# EAGLE schematic BEP33_2panel_test (EAGLE 6.4)

## Sheet 1 of 2
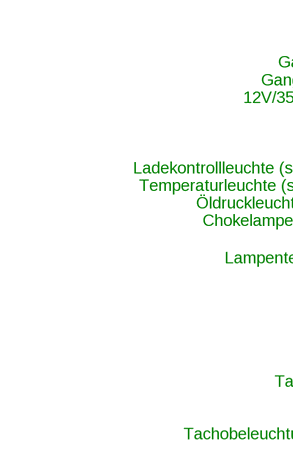
[diagram p0: schematic, sheet 1, part 1 of 2]
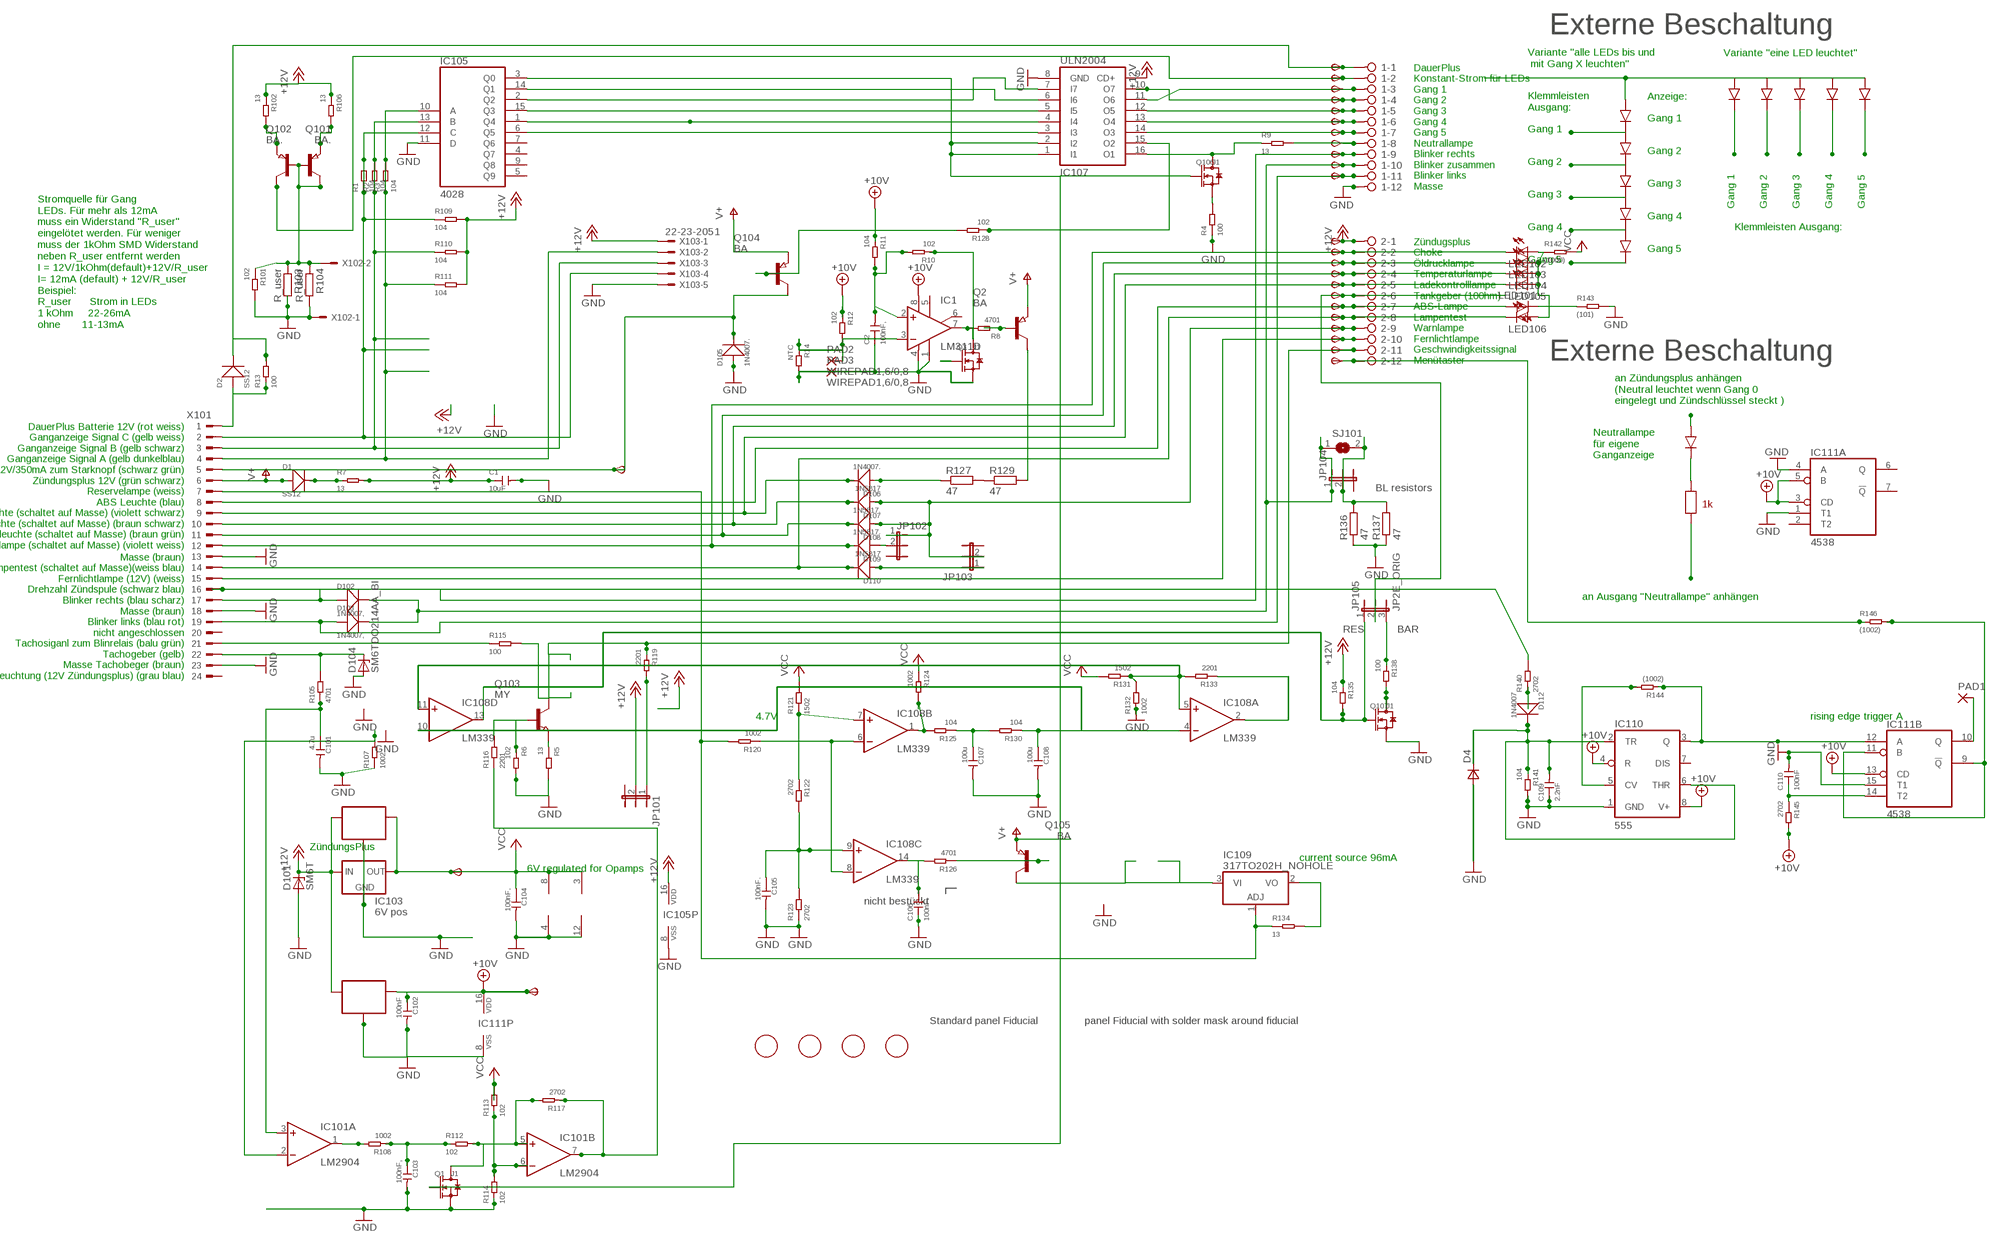
[diagram p1: schematic, sheet 1, part 2 of 2]

### Parts
1  2081-1132  [12-PIN]
2  2081-1132  [12-PIN]
6V  TPSB2.0  [B2.0]
10V  TPSB2.0  [B2.0]
C1  10uF  CERAMIC-100NF-50V-10%-X7R(0805)  [C0805]
C2  100nF,  CERAMIC-100NF-50V-10%-X7R(0805)  [C0805]
C101  4.7u  CERAMIC-4.7UF-25V-10%-X5R(0805)  [C0805]
C102  100nF  CERAMIC-100NF-50V-10%-X7R(0805)  [C0805]
C103  100nF,  CERAMIC-100NF-50V-10%-X7R(0805)  [C0805]
C104  100nF,  CERAMIC-100NF-50V-10%-X7R(0805)  [C0805]
C105  100nF.  CERAMIC-100NF-50V-10%-X7R(0805)  [C0805]
C106  100nF.  CERAMIC-100NF-50V-10%-X7R(0805)  [C0805]
C107  100u  CERAMIC-100UF-6.3V-20%-X5R(1206)  [C1206]
C108  100u  CERAMIC-100UF-6.3V-20%-X5R(1206)  [C1206]
C109  2.2nF  CERAMIC-100NF-50V-10%-X7R(0805)  [C0805]
C110  100nF  CERAMIC-100NF-50V-10%-X7R(0805)  [C0805]
D1  SS12  DIODE-GEN-PURPOSE-1KV-1A(DO-214AC)DO-214AC/1206  [DO-214AC_SLIM]
D2  SS12  DIODE-GEN-PURPOSE-1KV-1A(DO-214AC)DO-214AC/1206  [DO-214AC_SLIM]
D4  DSOD323  [SOD323]
D101  SM6T  [DO214AA]
D102  1N4007,  DIODE-GEN-PURPOSE-1KV-1A(DO-214AC)  [DO-214AC]
D103  1N4007,  DIODE-GEN-PURPOSE-1KV-1A(DO-214AC)  [DO-214AC]
D104  SM6TDO214AA_BI  [DO214AA_BI]
D105  1N4007.  DIODE-GEN-PURPOSE-1KV-1A(DO-214AC)  [DO-214AC]
D106  1N4007.  DIODE-GEN-PURPOSE-1KV-1A(DO-214AC)  [DO-214AC]
D107  1N5817  DIODE-GEN-PURPOSE-1KV-1A(DO-214AC)DO-214AC/1206  [DO-214AC_SLIM]
D108  1N5817.  DIODE-GEN-PURPOSE-1KV-1A(DO-214AC)DO-214AC/1206  [DO-214AC_SLIM]
D109  1N5817.  DIODE-GEN-PURPOSE-1KV-1A(DO-214AC)DO-214AC/1206  [DO-214AC_SLIM]
D110  1N5817  DIODE-GEN-PURPOSE-1KV-1A(DO-214AC)DO-214AC/1206  [DO-214AC_SLIM]
D112  1N4007  DIODE-GEN-PURPOSE-1KV-1A(DO-214AC)  [DO-214AC]
FID101  FIDUCIAL  [FIDUCIAL_1MM]
FID102  FIDUCIAL  [FIDUCIAL_1MM]
FID103  FIDUCIAL  [FIDUCIAL_1MM]
FID104  FIDUCIAL  [FIDUCIAL_1MM]
IC1  LM311D  [SO08]
IC101  LM2904  LM358D  [SO08]
IC102  78L06  78LXXSOT89_ROUND  [SOT89_ROUND]
IC103  6V pos  78LXX  [78LXX]
IC104  78L10  78LXXSOT89_ROUND  [SOT89_ROUND]
IC105  4028  4028D  [SO16]
IC107  ULN2004  ULN2004AD  [SO16]
IC108  LM339  LM339D  [SO14]
IC109  317TO202H_NOHOLE  [TO220H_NOHOLE]
IC110  555  NE555D  [SO08]
IC111  4538  4538D  [SO16]
JP101  JP2EJP2_SMALLPADS  [JP2_SMALLPADS]
JP102  JP2EJP2_SMALLPADS  [JP2_SMALLPADS]
JP103  JP2EJP2_SMALLPADS  [JP2_SMALLPADS]
JP104  JP2EJP2_SMALLPADS  [JP2_SMALLPADS]
JP105  JP2E_ORIG  [JP2_ORIG_SMALLPADS]
LED101  LEDLD260  [LD260]
LED102  LEDLD260  [LD260]
LED103  LEDLD260  [LD260]
LED104  LEDLD260  [LD260]
LED105  LEDLD260  [LD260]
LED106  LEDLD260  [LD260]
PAD1  1,6/0,8  [1,6/0,8]
PAD2  WIREPAD1,6/0,8  [1,6/0,8]
PAD3  WIREPAD1,6/0,8  [1,6/0,8]
Q1  J1  SMD-MOSFET-N-CH-50V-200MA-BSS138W-7-F(SOT-23)  [SOT-23]
Q2  BA  PNP-TRANSISTOR_SOT89  [SOT89]
Q3  J1  SMD-MOSFET-N-CH-50V-200MA-BSS138W-7-F(SOT-23)  [SOT-23]
Q101  BA.  PNP-TRANSISTOR_SOT89  [SOT89]
Q102  BA.  PNP-TRANSISTOR_SOT89  [SOT89]
Q103  MY  NPN-TRANSISTOR_SOT89  [SOT89]
Q104  BA  PNP-TRANSISTOR_SOT89  [SOT89]
Q105  BA  PNP-TRANSISTOR_SOT89  [SOT89]
Q106  J1  SMD-MOSFET-N-CH-50V-200MA-BSS138W-7-F(SOT-23)  [SOT-23]
Q107  J1  SMD-MOSFET-N-CH-50V-200MA-BSS138W-7-F(SOT-23)  [SOT-23]
R1  104  SMD-RES-10K-1%-1/8W(0805)  [R0805]
R2  104  SMD-RES-10K-1%-1/8W(0805)  [R0805]
R3  104  SMD-RES-10K-1%-1/8W(0805)  [R0805]
R4  100  SMD-RES-220R-5%-1/8W(0805)  [R0805]
R5  13  SMD-RES-13R-5%-1/4W(1206)  [R1206]
R6  102  SMD-RES-1K-5%-1/8W(0805)  [R0805]
R7  13  SMD-RES-13R-5%-1/4W(1206)  [R1206]
R8  4701  SMD-RES-4.7K-5%-1/8W(0805)  [R0805]
R9  13  SMD-RES-13R-5%-1/4W(1206)  [R1206]
R10  102  SMD-RES-1K-5%-1/8W(0805)  [R0805]
R11  104  SMD-RES-10K-1%-1/8W(0805)  [R0805]
R12  102  SMD-RES-1K-5%-1/8W(0805)  [R0805]
R13  100  SMD-RES-220R-5%-1/8W(0805)  [R0805]
R14  NTC  SMD-RES-1K-5%-1/8W(0805)  [R0805]
R101  102  SMD-RES-1K-5%-1/8W(0805)  [R0805]
R102  13  SMD-RES-13R-5%-1/4W(1206)  [R1206]
R103  R_user  R-EU_R0805  [R0805]
R104  R_user  R-EU_R0805  [R0805]
R105  4701  SMD-RES-4.7K-5%-1/8W(0805)  [R0805]
R106  13  SMD-RES-13R-5%-1/4W(1206)  [R1206]
R107  1002  SMD-RES-10K-1%-1/8W(0805)  [R0805]
R108  1002  SMD-RES-10K-1%-1/8W(0805)  [R0805]
R109  104  SMD-RES-10K-1%-1/8W(0805)  [R0805]
R110  104  SMD-RES-10K-1%-1/8W(0805)  [R0805]
R111  104  SMD-RES-10K-1%-1/8W(0805)  [R0805]
R112  102  SMD-RES-1K-5%-1/8W(0805)  [R0805]
R113  102  SMD-RES-1K-5%-1/8W(0805)  [R0805]
R114  102  SMD-RES-1K-5%-1/8W(0805)  [R0805]
R115  100  SMD-RES-220R-5%-1/8W(0805)  [R0805]
R116  2201  SMD-RES-4.7K-5%-1/8W(0805)  [R0805]
R117  2702  SMD-RES-4.7K-5%-1/8W(0805)  [R0805]
R119  2201  SMD-RES-2.2K-5%-1/8W(0805)  [R0805]
R120  1002  SMD-RES-10K-1%-1/8W(0805)  [R0805]
R121  1502  SMD-RES-10K-1%-1/8W(0805)  [R0805]
R122  2702  SMD-RES-4.7K-5%-1/8W(0805)  [R0805]
R123  2702  SMD-RES-4.7K-5%-1/8W(0805)  [R0805]
R124  1002  SMD-RES-10K-1%-1/8W(0805)  [R0805]
R125  104  SMD-RES-10K-1%-1/8W(0805)  [R0805]
R126  4701  SMD-RES-4.7K-5%-1/8W(0805)  [R0805]
R127  47  R-EU_V235/17_1MM  [V235/17_1MM]
R128  102  SMD-RES-1K-5%-1/8W(0805)  [R0805]
R129  47  R-EU_V235/17_1MM  [V235/17_1MM]
R130  104  SMD-RES-10K-1%-1/8W(0805)  [R0805]
R131  1502  SMD-RES-10K-1%-1/8W(0805)  [R0805]
R132  1002  SMD-RES-10K-1%-1/8W(0805)  [R0805]
R133  2201  SMD-RES-2.2K-5%-1/8W(0805)  [R0805]
R134  13  SMD-RES-13R-5%-1/4W(1206)  [R1206]
R135  104  SMD-RES-10K-1%-1/8W(0805)  [R0805]
R136  47  R-EU_V235/17_1MM  [V235/17_1MM]
R137  47  R-EU_V235/17_1MM  [V235/17_1MM]
R138  100  SMD-RES-2.2K-5%-1/8W(0805)  [R0805]
R140  2702  SMD-RES-10K-1%-1/8W(0805)  [R0805]
R141  104  SMD-RES-10K-1%-1/8W(0805)  [R0805]
R142  (1000)  SMD-RES-100R-5%-1/8W(0805)  [R0805]
R143  (101)  SMD-RES-100R-5%-1/8W(0805)  [R0805]
R144  (1002)  SMD-RES-10K-1%-1/8W(0805)  [R0805]
R145  2702  SMD-RES-4.7K-5%-1/8W(0805)  [R0805]
R146  (1002)  SMD-RES-4.7K-5%-1/8W(0805)  [R0805]
SJ101  SJ  [SJ]
START  TPSB2.0  [B2.0]
TP1  TPSB2.0  [B2.0]
TP2  TPSB2.0  [B2.0]
TP3  TPSB2.0  [B2.0]
TP4  TPSB2.0  [B2.0]
TP5  TPSB2.0  [B2.0]
TP6  TPSB2.0  [B2.0]
TP7  TPSB2.0  [B2.0]
TP8  TPSB2.0  [B2.0]
TP9  TPSB2.0  [B2.0]
TP10  TPSB2.0  [B2.0]
TP11  TPSB2.0  [B2.0]
TP12  TPSB2.0  [B2.0]
TP13  TPSB2.0  [B2.0]
TP16  TPSB2.0  [B2.0]
TP17  TPSB2.0  [B2.0]
TP18  TPSB2.0  [B2.0]
TP19  TPSB2.0  [B2.0]
TP21  TPSB2.0  [B2.0]
TP22  TPSB2.0  [B2.0]
TP23  TPSB2.0  [B2.0]
TP24  TPSB1,27  [B1,27]
TP25  TPSB2.0  [B2.0]
TP26  TPSB2.0  [B2.0]
X101  CON_BMWV2  [24-PIN_V2]
X102  22-23-2021  [22-23-2021]
X103  22-23-2051  [22-23-2051]

### Nets
+10V: 10V.TP(PP) C102.1 IC1.8(V+) IC104.1(OUT) IC110.4(R) IC110.8(V+) IC111.3(A:CD) IC111.5(A:B) IC111.13(B:CD) IC111.16(P:VDD) R11.1 R12.1 R145.2 ; also sheet 2
+12V: 2.1 C1.1 D101.C IC102.3(IN) IC103.IN IC104.3(IN) IC105.16(VDD) IC107.9(CD+) JP101.2 R7.2 R102.1 R106.1 R109.2 R110.2 R111.2 R135.1 TP12.TP(PP) X103.1 ; also sheet 2
+12V1: 2.11 Q103.2(C) R115.2 R119.1 TP26.TP(PP)
GND: 1.12 C1.2 C2.1 C101.2 C102.2 C103.2 C104.2 C105.2 C106.1 C107.2 C108.2 C109.1 C110.2 D4.2(A) D101.A D104.A D105.1(+) IC1.1(GND) IC1.4(V-) IC101.4(P:V-) IC102.2(GND) IC102.2@1(GND) IC103.GND IC104.2(GND) IC104.2@1(GND) IC105.8(VSS) IC105.11(D) IC107.8(GND) IC108.12(P:GND) IC110.1(GND) IC111.1(A:T1) IC111.4(A:A) IC111.8(P:VSS) IC111.15(B:T1) PAD3.1(P) Q1.2(S) Q3.2(S) Q107.2(S) R4.1 R5.2 R6.2 R14.2 R101.2 R103.2 R104.2 R107.1 R114.1 R123.1 R132.1 R136.1 R137.1 R141.2 R143.2 X101.13 X101.18 X101.23 X102.1 X103.5 ; also sheet 2
N$1: 2.9 D107.1(+) D108.1(+) JP102.1 JP103.2 TP24.TP(PP)
N$2: IC105.10(A) R3.1 R3.2 R111.1 X101.4 X103.2
N$3: IC105.13(B) R2.1 R2.2 R110.1 X101.3 X103.3
N$4: 2.7 LED101.A TP22.TP(PP) X101.8
N$5: Q101.3(E) R102.2
N$6: Q2.1(B) R8.1
N$7: IC101.2(A:-IN) R107.2
N$8: R127.2 R129.1
N$9: Q102.3(E) R106.2
N$11: D105.2(-) Q104.2(C) START.TP(PP) X101.5
N$12: 2.2 D109.2(-) LED102.K(C) TP16.TP(PP) X101.12
N$13: 2.3 D108.2(-) LED103.K(C) TP17.TP(PP) X101.11
N$14: 2.4 D107.2(-) LED104.K(C) TP18.TP(PP) X101.10
N$15: IC109.3(VI) Q105.2(C)
N$16: IC108.6(B:-IN) IC108.8(C:-IN) R120.1
N$17: IC105.12(C) R1.1 R1.2 R109.1 X101.2 X103.4
N$18: IC105.15(Q3) IC107.5(I5)
N$19: 2.8 D110.2(-) LED106.K(C) TP23.TP(PP) X101.14
N$20: 1.9 D102.1(+) TP9.TP(PP) X101.17
N$21: 1.11 D103.1(+) TP11.TP(PP) X101.19
N$22: IC111.9(B:!Q) IC111.11(B:B) R146.2
N$23: D104.C R105.2 X101.22
N$24: C101.1 IC101.3(A:+IN) R105.1
N$25: 1.6 IC107.13(O4) TP6.TP(PP)
N$26: 1.7 IC107.14(O3) TP7.TP(PP)
N$27: D1.2(-) R7.1
N$28: 2.6 JP105.2 TP21.TP(PP)
N$29: JP101.1 R119.2
N$30: C105.1 IC108.9(C:+IN) R122.2 R123.2
N$31: C106.2 IC108.14(C:OUT) R126.2
N$32: IC1.7(OUT) Q3.3(D) R8.2 R10.1
N$34: LED101.K(C) R143.1
N$35: IC109.1(ADJ) R120.2 R134.1 X101.7
N$36: Q105.1(B) R126.1
N$37: IC105.2(Q2) IC107.7(I7)
N$38: 1.3 IC107.11(O6) TP3.TP(PP)
N$39: 1.5 IC107.12(O5) TP5.TP(PP)
N$41: LED102.A LED103.A LED104.A LED105.A LED106.A R142.1
N$42: R140.2 X101.16
N$43: Q104.1(B) R128.2
N$44: IC105.3(Q0) IC107.1(I1) IC107.2(I2) Q1.1(G) Q106.1(G)
N$45: C107.1 R125.1 R130.2
N$46: C108.1 IC108.4(A:-IN) IC108.10(D:-IN) R130.1
N$47: IC108.5(A:+IN) IC108.11(D:+IN) R131.1 R132.2 R133.2
N$48: Q107.3(D) R138.2
N$49: Q3.1(G)
N$50: IC105.1(Q4) IC107.4(I4)
N$51: R115.1 X101.21
N$52: IC107.16(O1) Q106.3(D) R9.1
N$53: 2.10 TP25.TP(PP) X101.15
N$54: D106.1(+) R127.1
N$55: 2.5 D106.2(-) LED105.K(C) TP19.TP(PP) X101.9
N$56: IC105.14(Q1) IC107.6(I6)
N$57: Q101.1(B) Q102.1(B) Q102.2(C) R101.1 R103.1 R104.1 X102.2
N$58: 1.8 R9.2 TP8.TP(PP)
N$59: 1.2 Q101.2(C) TP2.TP(PP)
N$60: IC108.13(D:OUT) JP105.1 Q107.1(G) R135.2
N$61: IC105.6(Q5) IC107.3(I3)
N$64: IC109.2(VO) R134.2
N$65: IC110.5(CV) R144.2
N$67: 1.4 IC107.10(O7) TP4.TP(PP)
N$69: 1.1 D2.2(-) R13.2 TP1.TP(PP)
N$83: IC108.7(B:+IN) R121.1 R122.1
N$84: Q106.2(S) R4.2
N$85: Q103.1(B) R6.1 R116.2
N$86: IC110.3(Q) IC111.12(B:A) R144.1
N$87: D112.1(+) R140.1
N$88: IC107.15(O2) R128.1
N$89: C110.1 IC111.14(B:T2) R145.1
N$90: 2.12 R146.1 TP13.TP(PP)
N$91: D2.1(+) R13.1 X101.1
N$92: IC101.1(A:OUT) R108.2
N$93: 1.10 D102.2(-) D103.2(-) JP104.1 SJ101.1 TP10.TP(PP)
N$94: JP104.2 R136.2 R137.2 SJ101.2
N$95: D109.1(+) JP102.2
N$96: C103.1 R108.1 R112.1
N$97: IC101.5(B:+IN) Q1.3(D) R112.2 R117.2
N$98: D110.1(+) JP103.1
N$99: JP105.3 R138.1
N$100: Q103.3(E) R5.1
N$101: IC101.6(B:-IN) R113.1 R114.2
N$102: C109.2 D4.1(C) D112.2(-) IC110.2(TR) IC110.6(THR) R141.1
N$103: C2.2 IC1.2(+IN) R10.2 R11.2
N$104: Q2.2(C) R129.2
N$105: IC1.3(-IN) PAD2.1(P) R12.2 R14.1
N$106: IC111.10(B:Q) PAD1.1(P)
N$107: IC101.7(B:OUT) R116.1 R117.1
N$108: IC108.2(A:OUT) R133.1
N$580: IC108.1(B:OUT) R124.2 R125.2
V+: D1.1(+) Q2.3(E) Q104.3(E) Q105.3(E) X101.6 ; also sheet 2
VCC: 6V.TP(PP) C104.1 IC101.8(P:V+) IC102.1(OUT) IC103.OUT IC108.3(P:V+) R113.2 R121.2 R124.1 R131.2 R142.2 ; also sheet 2
Unconnected: IC1.5(ON) IC1.6(ON/STR) IC105.4(Q7) IC105.5(Q9) IC105.7(Q6) IC105.9(Q8) IC110.7(DIS) IC111.2(A:T2) IC111.6(A:Q) IC111.7(A:!Q) X101.20 X101.24

### Notes on the sheet
- Externe Beschaltung
- Variante "eine LED leuchtet"
- Variante "alle LEDs bis und
   mit Gang X leuchten"
- Anzeige:
- Klemmleisten
  Ausgang:
- Gang 1
- DauerPlus
  Konstant-Strom für LEDs
  Gang 1
  Gang 2
  Gang 3
  Gang 4
  Gang 5
  Neutrallampe
  Blinker rechts
  Blinker zusammen
  Blinker links
  Masse
- Gang 1
- Gang 2
- Gang 2
- Gang 3
- Gang 3
- Gang 1 | Gang 2 | Gang 3 | Gang 4 | Gang 5
- Gang 4
- Gang 4 | Klemmleisten Ausgang:
- Gang 5
- Gang 5
- Zündugsplus
  Choke
  Öldrucklampe
  Temperaturlampe
  Ladekontrolllampe
  Tankgeber (100hm)
  ABS-Lampe
  Lampentest
  Warnlampe
  Fernlichtlampe
  Geschwindigkeitssignal
  Menütaster
- Stromquelle für Gang
  LEDs. Für mehr als 12mA
  muss ein Widerstand "R_user"
  eingelötet werden. Für weniger
  muss der 1kOhm SMD Widerstand
  neben R_user entfernt werden
  I = 12V/1kOhm(default)+12V/R_user
  I= 12mA (default) + 12V/R_user
  Beispiel:
  R_user      Strom in LEDs
  1 kOhm     22-26mA
  ohne       11-13mA
- Externe Beschaltung
- an Zündungsplus anhängen
  (Neutral leuchtet wenn Gang 0
  eingelegt und Zündschlüssel steckt )
- Neutrallampe
  für eigene
  Ganganzeige
- DauerPlus Batterie 12V (rot weiss)
  Ganganzeige Signal C (gelb weiss)
  Ganganzeige Signal B (gelb schwarz)
  Ganganzeige Signal A (gelb dunkelblau)
  12V/350mA zum Starknopf (schwarz grün)
  Zündungsplus 12V (grün schwarz)
  Reservelampe (weiss)
  ABS Leuchte (blau)
  Ladekontrollleuchte (schaltet auf Masse) (violett schwarz)
  Temperaturleuchte (schaltet auf Masse) (braun schwarz)
  Öldruckleuchte (schaltet auf Masse) (braun grün)
  Chokelampe (schaltet auf Masse) (violett weiss)
- BL resistors
- 1k
- an Ausgang "Neutrallampe" anhängen
- Masse (braun)
  Lampentest (schaltet auf Masse)(weiss blau)
  Fernlichtlampe (12V) (weiss)
  Drehzahl Zündspule (schwarz blau)
  Blinker rechts (blau scharz)
  Masse (braun)
  Blinker links (blau rot)
  nicht angeschlossen
  Tachosiganl zum Blinrelais (balu grün)
  Tachogeber (gelb)
  Masse Tachobeger (braun)
  Tachobeleuchtung (12V Zündungsplus) (grau blau)
- RES | BAR
- 4.7V | rising edge trigger A
- ZündungsPlus
- current source 96mA
- 6V regulated for Opamps
- nicht bestückt
- Standard panel Fiducial | panel Fiducial with solder mask around fiducial

## Sheet 2 of 2
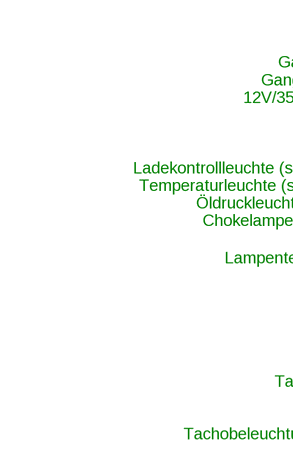
[diagram p2: schematic, sheet 2, part 1 of 2]
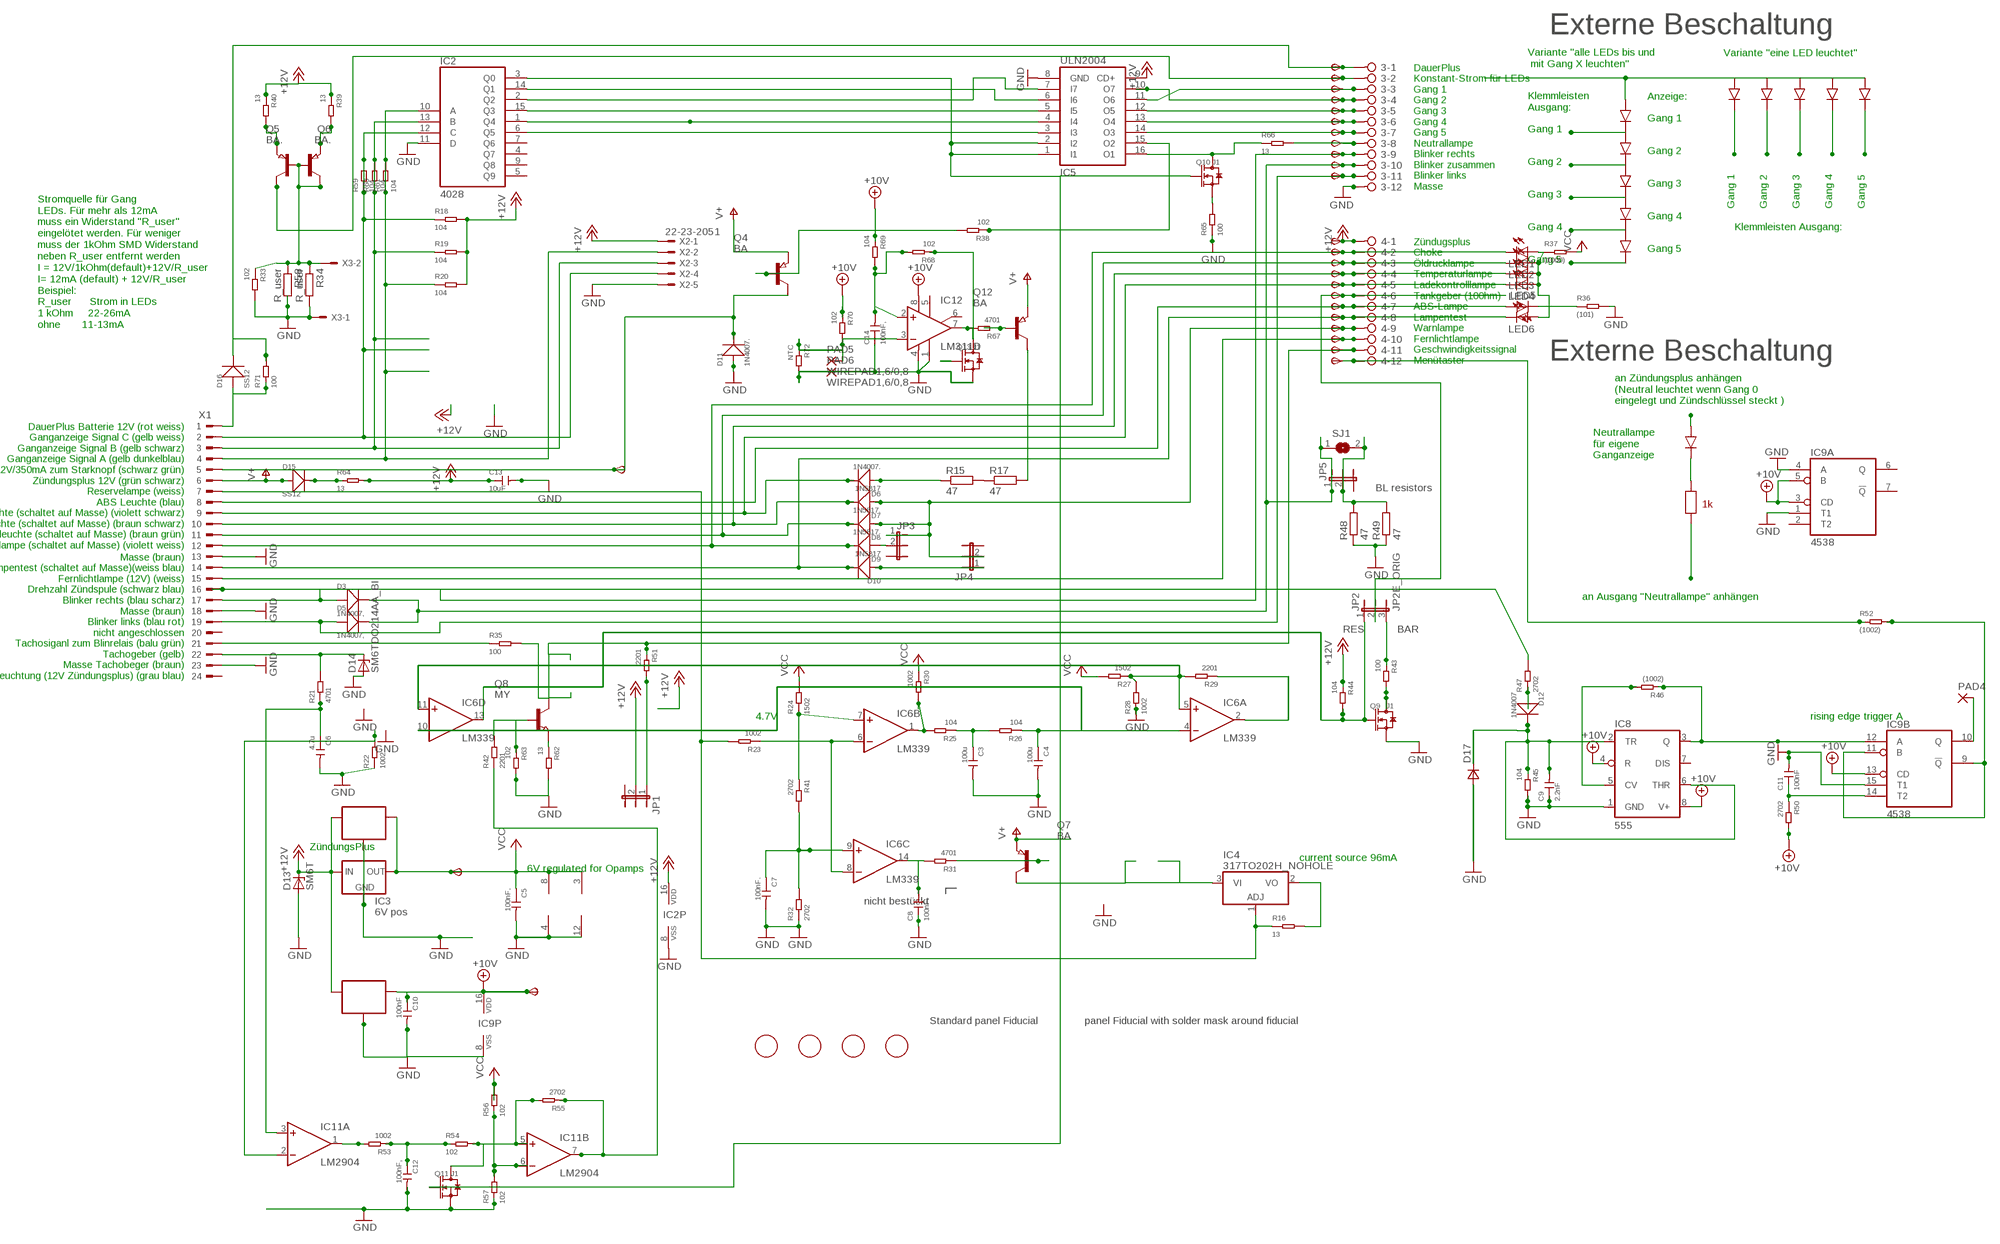
[diagram p3: schematic, sheet 2, part 2 of 2]

### Parts
3  2081-1132  [12-PIN]
4  2081-1132  [12-PIN]
6V1  TPSB2.0  [B2.0]
10V1  TPSB2.0  [B2.0]
C3  100u  CERAMIC-100UF-6.3V-20%-X5R(1206)  [C1206]
C4  100u  CERAMIC-100UF-6.3V-20%-X5R(1206)  [C1206]
C5  100nF,  CERAMIC-100NF-50V-10%-X7R(0805)  [C0805]
C6  4.7u  CERAMIC-4.7UF-25V-10%-X5R(0805)  [C0805]
C7  100nF.  CERAMIC-100NF-50V-10%-X7R(0805)  [C0805]
C8  100nF.  CERAMIC-100NF-50V-10%-X7R(0805)  [C0805]
C9  2.2nF  CERAMIC-100NF-50V-10%-X7R(0805)  [C0805]
C10  100nF  CERAMIC-100NF-50V-10%-X7R(0805)  [C0805]
C11  100nF  CERAMIC-100NF-50V-10%-X7R(0805)  [C0805]
C12  100nF,  CERAMIC-100NF-50V-10%-X7R(0805)  [C0805]
C13  10uF  CERAMIC-100NF-50V-10%-X7R(0805)  [C0805]
C14  100nF,  CERAMIC-100NF-50V-10%-X7R(0805)  [C0805]
D3  1N4007,  DIODE-GEN-PURPOSE-1KV-1A(DO-214AC)  [DO-214AC]
D5  1N4007,  DIODE-GEN-PURPOSE-1KV-1A(DO-214AC)  [DO-214AC]
D6  1N4007.  DIODE-GEN-PURPOSE-1KV-1A(DO-214AC)  [DO-214AC]
D7  1N5817  DIODE-GEN-PURPOSE-1KV-1A(DO-214AC)DO-214AC/1206  [DO-214AC_SLIM]
D8  1N5817.  DIODE-GEN-PURPOSE-1KV-1A(DO-214AC)DO-214AC/1206  [DO-214AC_SLIM]
D9  1N5817.  DIODE-GEN-PURPOSE-1KV-1A(DO-214AC)DO-214AC/1206  [DO-214AC_SLIM]
D10  1N5817  DIODE-GEN-PURPOSE-1KV-1A(DO-214AC)DO-214AC/1206  [DO-214AC_SLIM]
D11  1N4007.  DIODE-GEN-PURPOSE-1KV-1A(DO-214AC)  [DO-214AC]
D12  1N4007  DIODE-GEN-PURPOSE-1KV-1A(DO-214AC)  [DO-214AC]
D13  SM6T  [DO214AA]
D14  SM6TDO214AA_BI  [DO214AA_BI]
D15  SS12  DIODE-GEN-PURPOSE-1KV-1A(DO-214AC)DO-214AC/1206  [DO-214AC_SLIM]
D16  SS12  DIODE-GEN-PURPOSE-1KV-1A(DO-214AC)DO-214AC/1206  [DO-214AC_SLIM]
D17  DSOD323  [SOD323]
FID3  FIDUCIAL  [FIDUCIAL_1MM]
FID4  FIDUCIAL  [FIDUCIAL_1MM]
FID5  FIDUCIAL  [FIDUCIAL_1MM]
FID6  FIDUCIAL  [FIDUCIAL_1MM]
IC2  4028  4028D  [SO16]
IC3  6V pos  78LXX  [78LXX]
IC4  317TO202H_NOHOLE  [TO220H_NOHOLE]
IC5  ULN2004  ULN2004AD  [SO16]
IC6  LM339  LM339D  [SO14]
IC7  78L06  78LXXSOT89_ROUND  [SOT89_ROUND]
IC8  555  NE555D  [SO08]
IC9  4538  4538D  [SO16]
IC10  78L10  78LXXSOT89_ROUND  [SOT89_ROUND]
IC11  LM2904  LM358D  [SO08]
IC12  LM311D  [SO08]
JP1  JP2EJP2_SMALLPADS  [JP2_SMALLPADS]
JP2  JP2E_ORIG  [JP2_ORIG_SMALLPADS]
JP3  JP2EJP2_SMALLPADS  [JP2_SMALLPADS]
JP4  JP2EJP2_SMALLPADS  [JP2_SMALLPADS]
JP5  JP2EJP2_SMALLPADS  [JP2_SMALLPADS]
LED1  LEDLD260  [LD260]
LED2  LEDLD260  [LD260]
LED3  LEDLD260  [LD260]
LED4  LEDLD260  [LD260]
LED5  LEDLD260  [LD260]
LED6  LEDLD260  [LD260]
PAD4  1,6/0,8  [1,6/0,8]
PAD5  WIREPAD1,6/0,8  [1,6/0,8]
PAD6  WIREPAD1,6/0,8  [1,6/0,8]
Q4  BA  PNP-TRANSISTOR_SOT89  [SOT89]
Q5  BA.  PNP-TRANSISTOR_SOT89  [SOT89]
Q6  BA.  PNP-TRANSISTOR_SOT89  [SOT89]
Q7  BA  PNP-TRANSISTOR_SOT89  [SOT89]
Q8  MY  NPN-TRANSISTOR_SOT89  [SOT89]
Q9  J1  SMD-MOSFET-N-CH-50V-200MA-BSS138W-7-F(SOT-23)  [SOT-23]
Q10  J1  SMD-MOSFET-N-CH-50V-200MA-BSS138W-7-F(SOT-23)  [SOT-23]
Q11  J1  SMD-MOSFET-N-CH-50V-200MA-BSS138W-7-F(SOT-23)  [SOT-23]
Q12  BA  PNP-TRANSISTOR_SOT89  [SOT89]
Q13  J1  SMD-MOSFET-N-CH-50V-200MA-BSS138W-7-F(SOT-23)  [SOT-23]
R15  47  R-EU_V235/17_1MM  [V235/17_1MM]
R16  13  SMD-RES-13R-5%-1/4W(1206)  [R1206]
R17  47  R-EU_V235/17_1MM  [V235/17_1MM]
R18  104  SMD-RES-10K-1%-1/8W(0805)  [R0805]
R19  104  SMD-RES-10K-1%-1/8W(0805)  [R0805]
R20  104  SMD-RES-10K-1%-1/8W(0805)  [R0805]
R21  4701  SMD-RES-4.7K-5%-1/8W(0805)  [R0805]
R22  1002  SMD-RES-10K-1%-1/8W(0805)  [R0805]
R23  1002  SMD-RES-10K-1%-1/8W(0805)  [R0805]
R24  1502  SMD-RES-10K-1%-1/8W(0805)  [R0805]
R25  104  SMD-RES-10K-1%-1/8W(0805)  [R0805]
R26  104  SMD-RES-10K-1%-1/8W(0805)  [R0805]
R27  1502  SMD-RES-10K-1%-1/8W(0805)  [R0805]
R28  1002  SMD-RES-10K-1%-1/8W(0805)  [R0805]
R29  2201  SMD-RES-2.2K-5%-1/8W(0805)  [R0805]
R30  1002  SMD-RES-10K-1%-1/8W(0805)  [R0805]
R31  4701  SMD-RES-4.7K-5%-1/8W(0805)  [R0805]
R32  2702  SMD-RES-4.7K-5%-1/8W(0805)  [R0805]
R33  102  SMD-RES-1K-5%-1/8W(0805)  [R0805]
R34  R_user  R-EU_R0805  [R0805]
R35  100  SMD-RES-220R-5%-1/8W(0805)  [R0805]
R36  (101)  SMD-RES-100R-5%-1/8W(0805)  [R0805]
R37  (1000)  SMD-RES-100R-5%-1/8W(0805)  [R0805]
R38  102  SMD-RES-1K-5%-1/8W(0805)  [R0805]
R39  13  SMD-RES-13R-5%-1/4W(1206)  [R1206]
R40  13  SMD-RES-13R-5%-1/4W(1206)  [R1206]
R41  2702  SMD-RES-4.7K-5%-1/8W(0805)  [R0805]
R42  2201  SMD-RES-4.7K-5%-1/8W(0805)  [R0805]
R43  100  SMD-RES-2.2K-5%-1/8W(0805)  [R0805]
R44  104  SMD-RES-10K-1%-1/8W(0805)  [R0805]
R45  104  SMD-RES-10K-1%-1/8W(0805)  [R0805]
R46  (1002)  SMD-RES-10K-1%-1/8W(0805)  [R0805]
R47  2702  SMD-RES-10K-1%-1/8W(0805)  [R0805]
R48  47  R-EU_V235/17_1MM  [V235/17_1MM]
R49  47  R-EU_V235/17_1MM  [V235/17_1MM]
R50  2702  SMD-RES-4.7K-5%-1/8W(0805)  [R0805]
R51  2201  SMD-RES-2.2K-5%-1/8W(0805)  [R0805]
R52  (1002)  SMD-RES-4.7K-5%-1/8W(0805)  [R0805]
R53  1002  SMD-RES-10K-1%-1/8W(0805)  [R0805]
R54  102  SMD-RES-1K-5%-1/8W(0805)  [R0805]
R55  2702  SMD-RES-4.7K-5%-1/8W(0805)  [R0805]
R56  102  SMD-RES-1K-5%-1/8W(0805)  [R0805]
R57  102  SMD-RES-1K-5%-1/8W(0805)  [R0805]
R58  R_user  R-EU_R0805  [R0805]
R59  104  SMD-RES-10K-1%-1/8W(0805)  [R0805]
R60  104  SMD-RES-10K-1%-1/8W(0805)  [R0805]
R61  104  SMD-RES-10K-1%-1/8W(0805)  [R0805]
R62  13  SMD-RES-13R-5%-1/4W(1206)  [R1206]
R63  102  SMD-RES-1K-5%-1/8W(0805)  [R0805]
R64  13  SMD-RES-13R-5%-1/4W(1206)  [R1206]
R65  100  SMD-RES-220R-5%-1/8W(0805)  [R0805]
R66  13  SMD-RES-13R-5%-1/4W(1206)  [R1206]
R67  4701  SMD-RES-4.7K-5%-1/8W(0805)  [R0805]
R68  102  SMD-RES-1K-5%-1/8W(0805)  [R0805]
R69  104  SMD-RES-10K-1%-1/8W(0805)  [R0805]
R70  102  SMD-RES-1K-5%-1/8W(0805)  [R0805]
R71  100  SMD-RES-220R-5%-1/8W(0805)  [R0805]
R72  NTC  SMD-RES-1K-5%-1/8W(0805)  [R0805]
SJ1  SJ  [SJ]
START1  TPSB2.0  [B2.0]
TP14  TPSB2.0  [B2.0]
TP15  TPSB2.0  [B2.0]
TP20  TPSB2.0  [B2.0]
TP27  TPSB2.0  [B2.0]
TP28  TPSB2.0  [B2.0]
TP29  TPSB2.0  [B2.0]
TP30  TPSB2.0  [B2.0]
TP31  TPSB2.0  [B2.0]
TP32  TPSB2.0  [B2.0]
TP33  TPSB2.0  [B2.0]
TP34  TPSB2.0  [B2.0]
TP35  TPSB2.0  [B2.0]
TP36  TPSB2.0  [B2.0]
TP37  TPSB2.0  [B2.0]
TP38  TPSB2.0  [B2.0]
TP39  TPSB2.0  [B2.0]
TP40  TPSB2.0  [B2.0]
TP41  TPSB2.0  [B2.0]
TP42  TPSB1,27  [B1,27]
TP43  TPSB2.0  [B2.0]
TP44  TPSB2.0  [B2.0]
TP45  TPSB2.0  [B2.0]
TP46  TPSB2.0  [B2.0]
X1  CON_BMWV2  [24-PIN_V2]
X2  22-23-2051  [22-23-2051]
X3  22-23-2021  [22-23-2021]

### Nets
+10V: 10V1.TP(PP) C10.1 IC8.4(R) IC8.8(V+) IC9.3(A:CD) IC9.5(A:B) IC9.13(B:CD) IC9.16(P:VDD) IC10.1(OUT) IC12.8(V+) R50.2 R69.1 R70.1 ; also sheet 1
+12V: 4.1 C13.1 D13.C IC2.16(VDD) IC3.IN IC5.9(CD+) IC7.3(IN) IC10.3(IN) JP1.2 R18.2 R19.2 R20.2 R39.1 R40.1 R44.1 R64.2 TP45.TP(PP) X2.1 ; also sheet 1
+12V2: 4.11 Q8.2(C) R35.2 R51.1 TP44.TP(PP)
GND: 3.12 C3.2 C4.2 C5.2 C6.2 C7.2 C8.1 C9.1 C10.2 C11.2 C12.2 C13.2 C14.1 D11.1(+) D13.A D14.A D17.2(A) IC2.8(VSS) IC2.11(D) IC3.GND IC5.8(GND) IC6.12(P:GND) IC7.2(GND) IC7.2@1(GND) IC8.1(GND) IC9.1(A:T1) IC9.4(A:A) IC9.8(P:VSS) IC9.15(B:T1) IC10.2(GND) IC10.2@1(GND) IC11.4(P:V-) IC12.1(GND) IC12.4(V-) PAD6.1(P) Q9.2(S) Q11.2(S) Q13.2(S) R22.1 R28.1 R32.1 R33.2 R34.2 R36.2 R45.2 R48.1 R49.1 R57.1 R58.2 R62.2 R63.2 R65.1 R72.2 X1.13 X1.18 X1.23 X2.5 X3.1 ; also sheet 1
N$109: R15.2 R17.1
N$110: 4.9 D7.1(+) D8.1(+) JP3.1 JP4.2 TP42.TP(PP)
N$111: IC2.10(A) R20.1 R61.1 R61.2 X1.4 X2.2
N$112: IC2.13(B) R19.1 R60.1 R60.2 X1.3 X2.3
N$113: D11.2(-) Q4.2(C) START1.TP(PP) X1.5
N$114: IC2.12(C) R18.1 R59.1 R59.2 X1.2 X2.4
N$115: 4.7 LED5.A TP40.TP(PP) X1.8
N$116: 4.2 D9.2(-) LED1.K(C) TP35.TP(PP) X1.12
N$117: 4.3 D8.2(-) LED2.K(C) TP36.TP(PP) X1.11
N$118: 4.4 D7.2(-) LED3.K(C) TP37.TP(PP) X1.10
N$119: 4.8 D10.2(-) LED6.K(C) TP41.TP(PP) X1.14
N$120: 3.9 D3.1(+) TP32.TP(PP) X1.17
N$121: 3.11 D5.1(+) TP34.TP(PP) X1.19
N$122: D14.C R21.2 X1.22
N$123: C6.1 IC11.3(A:+IN) R21.1
N$124: IC6.1(B:OUT) R25.2 R30.2
N$125: C3.1 R25.1 R26.2
N$126: C4.1 IC6.4(A:-IN) IC6.10(D:-IN) R26.1
N$127: IC6.5(A:+IN) IC6.11(D:+IN) R27.1 R28.2 R29.2
N$128: C7.1 IC6.9(C:+IN) R32.2 R41.2
N$129: C8.2 IC6.14(C:OUT) R31.2
N$130: Q7.1(B) R31.1
N$131: IC2.2(Q2) IC5.7(I7)
N$132: 3.5 IC5.12(O5) TP28.TP(PP)
N$133: IC2.1(Q4) IC5.4(I4)
N$134: 4.10 TP43.TP(PP) X1.15
N$135: 4.5 D6.2(-) LED4.K(C) TP38.TP(PP) X1.9
N$136: D6.1(+) R15.1
N$137: IC2.6(Q5) IC5.3(I3)
N$138: 3.4 IC5.10(O7) TP27.TP(PP)
N$139: IC4.1(ADJ) R16.1 R23.2 X1.7
N$140: IC6.6(B:-IN) IC6.8(C:-IN) R23.1
N$141: 3.2 Q6.2(C) TP15.TP(PP)
N$142: 3.1 D16.2(-) R71.2 TP14.TP(PP)
N$156: R47.2 X1.16
N$157: IC2.15(Q3) IC5.5(I5)
N$158: 3.6 IC5.13(O4) TP29.TP(PP)
N$159: 3.7 IC5.14(O3) TP30.TP(PP)
N$160: 4.6 JP2.2 TP39.TP(PP)
N$161: LED5.K(C) R36.1
N$162: LED1.A LED2.A LED3.A LED4.A LED6.A R37.1
N$163: Q4.1(B) R38.2
N$164: IC2.3(Q0) IC5.1(I1) IC5.2(I2) Q10.1(G) Q11.1(G)
N$165: IC2.14(Q1) IC5.6(I6)
N$166: 3.3 IC5.11(O6) TP20.TP(PP)
N$167: Q5.1(B) Q5.2(C) Q6.1(B) R33.1 R34.1 R58.1 X3.2
N$168: Q6.3(E) R40.2
N$169: Q5.3(E) R39.2
N$170: IC6.7(B:+IN) R24.1 R41.1
N$171: IC11.2(A:-IN) R22.2
N$172: Q8.1(B) R42.2 R63.1
N$173: Q9.3(D) R43.2
N$174: IC4.2(VO) R16.2
N$175: IC4.3(VI) Q7.2(C)
N$176: IC8.5(CV) R46.2
N$177: IC8.3(Q) IC9.12(B:A) R46.1
N$178: D12.1(+) R47.1
N$179: 3.10 D3.2(-) D5.2(-) JP5.1 SJ1.1 TP33.TP(PP)
N$180: JP5.2 R48.2 R49.2 SJ1.2
N$181: IC9.9(B:!Q) IC9.11(B:B) R52.2
N$182: C11.1 IC9.14(B:T2) R50.1
N$183: JP1.1 R51.2
N$184: IC5.15(O2) R38.1
N$185: 4.12 R52.1 TP46.TP(PP)
N$186: D9.1(+) JP3.2
N$187: IC11.1(A:OUT) R53.2
N$188: C12.1 R53.1 R54.1
N$189: IC11.5(B:+IN) Q11.3(D) R54.2 R55.2
N$190: IC11.6(B:-IN) R56.1 R57.2
N$196: D10.1(+) JP4.1
N$197: JP2.3 R43.1
N$198: IC6.13(D:OUT) JP2.1 Q9.1(G) R44.2
N$199: R35.1 X1.21
N$200: IC5.16(O1) Q10.3(D) R66.1
N$201: D15.2(-) R64.1
N$202: 3.8 R66.2 TP31.TP(PP)
N$203: Q10.2(S) R65.2
N$204: D16.1(+) R71.1 X1.1
N$205: Q8.3(E) R62.1
N$206: C9.2 D12.2(-) D17.1(C) IC8.2(TR) IC8.6(THR) R45.1
N$207: Q12.1(B) R67.1
N$208: IC12.7(OUT) Q13.3(D) R67.2 R68.1
N$209: C14.2 IC12.2(+IN) R68.2 R69.2
N$210: IC12.3(-IN) PAD5.1(P) R70.2 R72.1
N$211: Q12.2(C) R17.2
N$212: IC9.10(B:Q) PAD4.1(P)
N$213: IC11.7(B:OUT) R42.1 R55.1
N$214: IC6.2(A:OUT) R29.1
N$215: Q13.1(G)
V+: D15.1(+) Q4.3(E) Q7.3(E) Q12.3(E) X1.6 ; also sheet 1
VCC: 6V1.TP(PP) C5.1 IC3.OUT IC6.3(P:V+) IC7.1(OUT) IC11.8(P:V+) R24.2 R27.2 R30.1 R37.2 R56.2 ; also sheet 1
Unconnected: IC2.4(Q7) IC2.5(Q9) IC2.7(Q6) IC2.9(Q8) IC8.7(DIS) IC9.2(A:T2) IC9.6(A:Q) IC9.7(A:!Q) IC12.5(ON) IC12.6(ON/STR) X1.20 X1.24

### Notes on the sheet
- Externe Beschaltung
- Variante "eine LED leuchtet"
- Variante "alle LEDs bis und
   mit Gang X leuchten"
- Anzeige:
- Klemmleisten
  Ausgang:
- Gang 1
- DauerPlus
  Konstant-Strom für LEDs
  Gang 1
  Gang 2
  Gang 3
  Gang 4
  Gang 5
  Neutrallampe
  Blinker rechts
  Blinker zusammen
  Blinker links
  Masse
- Gang 1
- Gang 2
- Gang 2
- Gang 3
- Gang 3
- Gang 1 | Gang 2 | Gang 3 | Gang 4 | Gang 5
- Gang 4
- Gang 4 | Klemmleisten Ausgang:
- Gang 5
- Gang 5
- Zündugsplus
  Choke
  Öldrucklampe
  Temperaturlampe
  Ladekontrolllampe
  Tankgeber (100hm)
  ABS-Lampe
  Lampentest
  Warnlampe
  Fernlichtlampe
  Geschwindigkeitssignal
  Menütaster
- Stromquelle für Gang
  LEDs. Für mehr als 12mA
  muss ein Widerstand "R_user"
  eingelötet werden. Für weniger
  muss der 1kOhm SMD Widerstand
  neben R_user entfernt werden
  I = 12V/1kOhm(default)+12V/R_user
  I= 12mA (default) + 12V/R_user
  Beispiel:
  R_user      Strom in LEDs
  1 kOhm     22-26mA
  ohne       11-13mA
- Externe Beschaltung
- an Zündungsplus anhängen
  (Neutral leuchtet wenn Gang 0
  eingelegt und Zündschlüssel steckt )
- Neutrallampe
  für eigene
  Ganganzeige
- DauerPlus Batterie 12V (rot weiss)
  Ganganzeige Signal C (gelb weiss)
  Ganganzeige Signal B (gelb schwarz)
  Ganganzeige Signal A (gelb dunkelblau)
  12V/350mA zum Starknopf (schwarz grün)
  Zündungsplus 12V (grün schwarz)
  Reservelampe (weiss)
  ABS Leuchte (blau)
  Ladekontrollleuchte (schaltet auf Masse) (violett schwarz)
  Temperaturleuchte (schaltet auf Masse) (braun schwarz)
  Öldruckleuchte (schaltet auf Masse) (braun grün)
  Chokelampe (schaltet auf Masse) (violett weiss)
- BL resistors
- 1k
- an Ausgang "Neutrallampe" anhängen
- Masse (braun)
  Lampentest (schaltet auf Masse)(weiss blau)
  Fernlichtlampe (12V) (weiss)
  Drehzahl Zündspule (schwarz blau)
  Blinker rechts (blau scharz)
  Masse (braun)
  Blinker links (blau rot)
  nicht angeschlossen
  Tachosiganl zum Blinrelais (balu grün)
  Tachogeber (gelb)
  Masse Tachobeger (braun)
  Tachobeleuchtung (12V Zündungsplus) (grau blau)
- RES | BAR
- 4.7V | rising edge trigger A
- ZündungsPlus
- current source 96mA
- 6V regulated for Opamps
- nicht bestückt
- Standard panel Fiducial | panel Fiducial with solder mask around fiducial

## Library data of the parts
1-4 = con WAGO BMW:2081-1132: WAGO SREW CLAMP
6V 6V1 10V 10V1 START START1 TP1-TP46 = testpin_BMW:TPS: TEST PIN
C1 C2 C5 C7-C14 C102-C106 C109 C110 = Seeed-Capacitor-2016:CERAMIC-100NF-50V-10%-X7R(0805): 302010165; MPN: CC0805KRX7R9BB104; VALUE: 100nf
C3 C4 C107 C108 = Seeed-Capacitor-2016:CERAMIC-100UF-6.3V-20%-X5R(1206): 302010183; MPN: GRM31CR60J107ME39L; VALUE: 100uf
C6 C101 = Seeed-Capacitor-2016:CERAMIC-4.7UF-25V-10%-X5R(0805): 302010146; MPN: CC0805KKX5R8BB475; VALUE: 4.7uf
D1 D2 D7-D10 D15 D16 D107-D110 = Diode-do214ac:DIODE-GEN-PURPOSE-1KV-1A(DO-214AC): 304010013
D3 D5 D6 D11 D102 D103 D105 D106 = Diode-do214ac:DIODE-GEN-PURPOSE-1KV-1A(DO-214AC): 304010013; MPN: 1N4007; VALUE: 1N4007
D4 D17 = zetex:D: DIODE; MPN: CDSOD323-T05C; OC_FARNELL: 1824860; OC_NEWARK: 79R6078
D12 D112 = Diode-do214ac:DIODE-GEN-PURPOSE-1KV-1A(DO-214AC): 304010013; MPN: 1N4007
D13 D14 D101 D104 = Suppressor_Diode_DO214AA:SM6T: Z DIODE
FID3-FID6 FID101-FID104 = Fiducial:FIDUCIAL: For use by pick and place machines to calibrate the vision/machine, 1mm By microbuilder.eu
IC1 IC12 = linear:LM311: COMPARATOR
IC2 IC105 = 4028:4028: BCD to decimal DECODER
IC3 IC103 = v-reg:78LXX: VOLTAGE REGULATOR
IC4 IC109 = linear_BMW:*317: Positive VOLTAGE REGULATOR
IC5 IC107 = uln-udn:ULN2004A: DRIVER ARRAY
IC6 IC108 = LM339:LM339: Low Power Low Offset Voltage Quad Comparators with open collector; LM139/LM239/LM339/LM2901/LM3302
IC7 IC10 IC102 IC104 = 78LXX:78LXX
IC8 IC110 = linear:*555: TIMER
IC9 IC111 = 45xx:4538: Dual precision monostable MULTIVIBRATOR
IC11 IC101 = linear_BMW:LM358: OP AMP also LM158; LM258; LM2904 Source: http://cache.national.com/ds/LM/LM158.pdf
JP1 JP3-JP5 JP101-JP104 = Switch Aliexpress 2:JP2E: JUMPER
JP2 JP105 = Switch Aliexpress 2:JP2E_ORIG
LED1-LED6 LED101-LED106 = led:LED: LED OSRAM: - CHIPLED LG R971, LG N971, LY N971, LG Q971, LY Q971, LO R971, LY R971 LH N974, LH R974 LS Q976, LO Q976, LY Q976 LO Q996 - Hyper CHIPLED LW Q18S LB Q993, LB Q99A, LB R99A - SideLED LS A670, LO A670, LY A670, LG A670, LP A670 LB A673, LV A673, LT A673, LW A673 LH A674 LY A675 LS A676, LA A676, LO A676, LY A676, LW A676 LS A679, LY A679, LG A679 - Hyper Micro SIDELED® LS Y876, LA Y876, LO Y876, LY Y876 LT Y87S - SmartLED LW L88C, LW L88S LB L89C, LB L89S, LG L890 LS L89K, LO L89K, LY L89K LS L896, LA L896, LO L896, LY L896 - TOPLED LS T670, LO T670, LY T670, LG T670, LP T670 LSG T670, LSP T670, LSY T670, LOP T670, LYG T670 LG T671, LOG T671, LSG T671 LB T673, LV T673, LT T673, LW T673 LH T674 LS T676, LA T676, LO T676, LY T676, LB T676, LH T676, LSB T676, LW T676 LB T67C, LV T67C, LT T67C, LS T67K, LO T67K, LY T67K, LW E67C LS E67B, LA E67B, LO E67B, LY E67B, LB E67C, LV E67C, LT E67C LW T67C LS T679, LY T679, LG T679 LS T770, LO T770, LY T770, LG T770, LP T770 LB T773, LV T773, LT T773, LW T773 LH T774 LS E675, LA E675, LY E675, LS T675 LS T776, LA T776, LO T776, LY T776, LB T776 LHGB T686 LT T68C, LB T68C - Hyper Mini TOPLED® LB M676 - Mini TOPLED Santana® LG M470 LS M47K, LO M47K, LY M47K Source: http://www.osram.convergy.de LUXEON: - LUMILED® LXK2-PW12-R00, LXK2-PW12-S00, LXK2-PW14-U00, LXK2-PW14-V00 LXK2-PM12-R00, LXK2-PM12-S00, LXK2-PM14-U00 LXK2-PE12-Q00, LXK2-PE12-R00, LXK2-PE12-S00, LXK2-PE14-T00, LXK2-PE14-U00 LXK2-PB12-K00, LXK2-PB12-L00, LXK2-PB12-M00, LXK2-PB14-N00, LXK2-PB14-P00, LXK2-PB14-Q00 LXK2-PR12-L00, LXK2-PR12-M00, LXK2-PR14-Q00, LXK2-PR14-R00 LXK2-PD12-Q00, LXK2-PD12-R00, LXK2-PD12-S00 LXK2-PH12-R00, LXK2-PH12-S00 LXK2-PL12-P00, LXK2-PL12-Q00, LXK2-PL12-R00 Source: www.luxeon.com KINGBRIGHT: KA-3528ASYC Source: www.kingbright.com
PAD1 PAD4 = wirepad:1,6/0,8: THROUGH-HOLE PAD
PAD2 PAD3 PAD5 PAD6 = wirepad:WIREPAD: Wire PAD connect wire on PCB
Q1 Q3 Q9-Q11 Q13 Q106 Q107 = Seeed-Transistor-2016:SMD-MOSFET-N-CH-50V-200MA-BSS138W-7-F(SOT-23): 305030000; MPN: BSS138W-7-F; VALUE: BSS138W-7-F
Q2 Q4-Q7 Q12 Q101 Q102 Q104 Q105 = Transistor_SOT89:PNP-TRANSISTOR_: PNP TRANSISTOR
Q8 Q103 = Transistor_SOT89:NPN-TRANSISTOR_: NPN TRANSISTOR
R1-R3 R11 R18-R20 R22-R28 R30 R44-R47 R53 R59-R61 R69 R107-R111 R120 R121 R124 R125 R130-R132 R135 R140 R141 R144 = Seeed-Resistor-2016:SMD-RES-10K-1%-1/8W(0805): 301010361; MPN: RC0805FR-0710KL; VALUE: 10K
R4 R13 R35 R65 R71 R115 = Seeed-Resistor-2016:SMD-RES-220R-5%-1/8W(0805): 301010315; MPN: RC0805JR-07220RL; VALUE: 220R
R5 R7 R9 R16 R39 R40 R62 R64 R66 R102 R106 R134 = Seeed-Resistor-2016:SMD-RES-13R-5%-1/4W(1206): 301010405; MPN: RC1206JR-0713RL; VALUE: 13R
R6 R10 R12 R14 R33 R38 R54 R56 R57 R63 R68 R70 R72 R101 R112-R114 R128 = Seeed-Resistor-2016:SMD-RES-1K-5%-1/8W(0805): 301010311; MPN: RC0805JR-071KL; VALUE: 1K
R8 R21 R31 R32 R41 R42 R50 R52 R55 R67 R105 R116 R117 R122 R123 R126 R145 R146 = Seeed-Resistor-2016:SMD-RES-4.7K-5%-1/8W(0805): 301010306; MPN: RC0805JR-074K7L; VALUE: 4.7K
R15 R17 R34 R48 R49 R58 R103 R104 R127 R129 R136 R137 = rcl:R-EU_: RESISTOR, European symbol
R29 R43 R51 R119 R133 R138 = Seeed-Resistor-2016:SMD-RES-2.2K-5%-1/8W(0805): 301010333; MPN: RC0805JR-072K2L; VALUE: 2.2K
R36 R37 R142 R143 = Seeed-Resistor-2016:SMD-RES-100R-5%-1/8W(0805): 301010319; MPN: RC0805JR-07100RL; VALUE: 100R
SJ1 SJ101 = solder-jumper:SJ: SMD solder JUMPER
X1 X101 = con_BMW:CON_BMW: BMW CONNECTOR
X2 X103 = con_Molex_BMW:22-23-2051: .100" (2.54mm) Center Header - 5 Pin; MF: MOLEX; MPN: 22-23-2051; OC_FARNELL: 1462952; OC_NEWARK: 38C9178
X3 X102 = con_Molex_BMW:22-23-2021: .100" (2.54mm) Center Header - 2 Pin; MF: MOLEX; MPN: 22-23-2021; OC_FARNELL: 1462926; OC_NEWARK: 25C3832